# Altium schematic sheet TopView.SchDoc
size A4
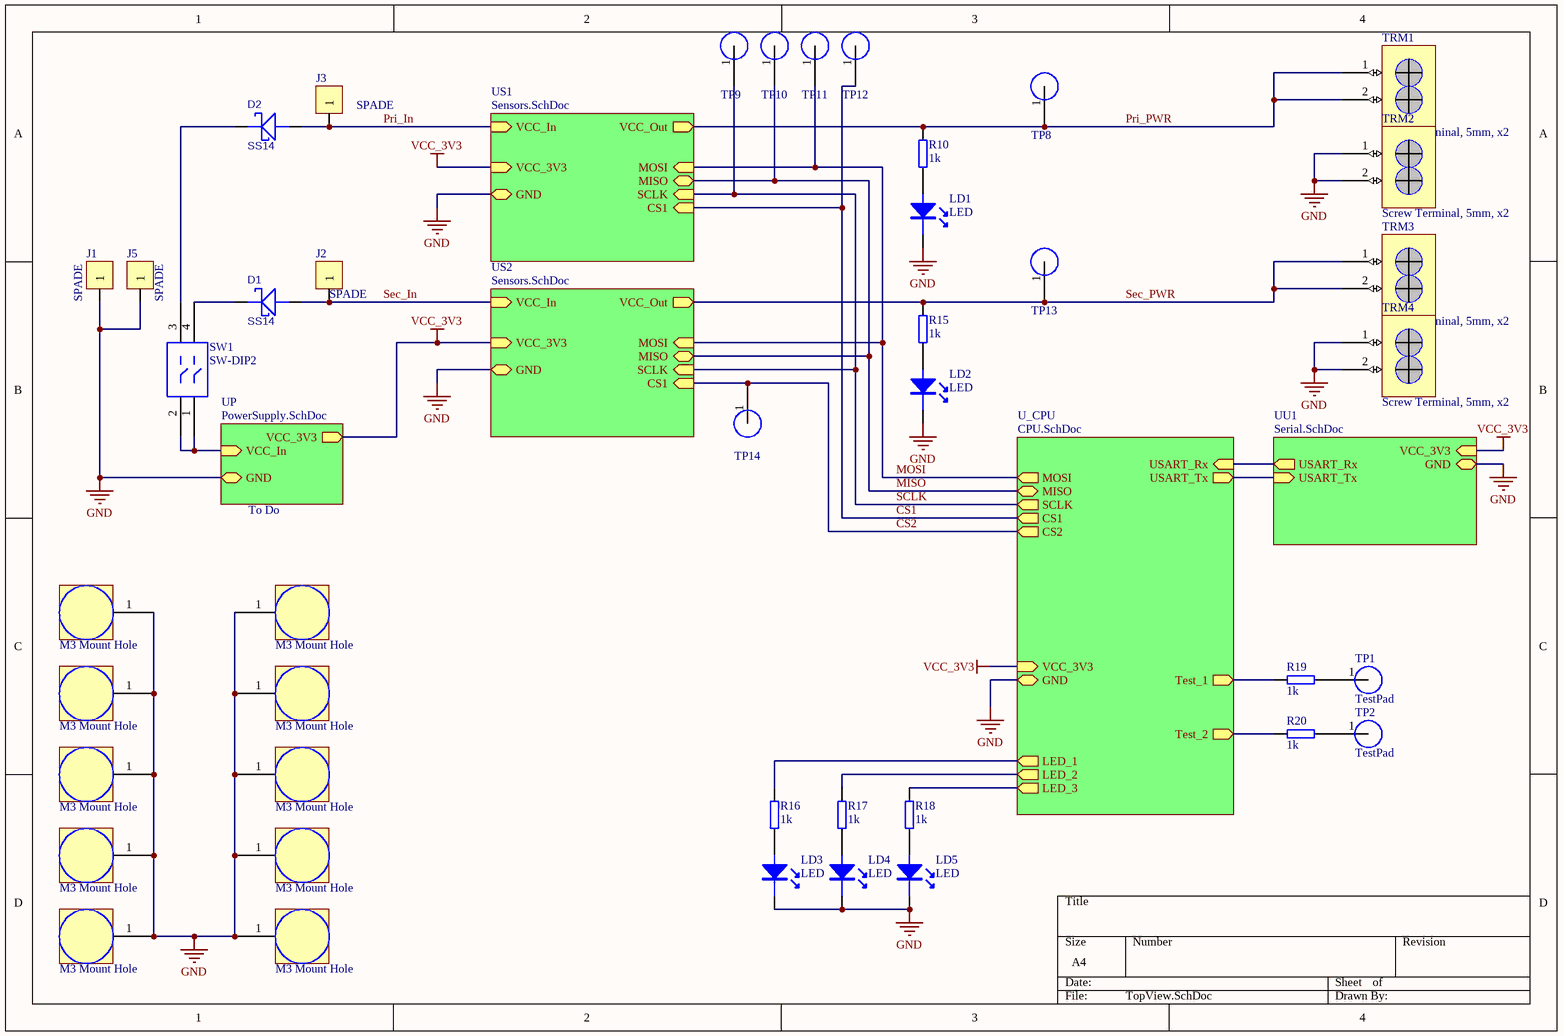
[diagram p0: TopView.SchDoc]

## Parts
D1  SS14  [DO-214AC]
D2  SS14  [DO-214AC]
J1  SPADE  [SPADE6.3-V]
J2  SPADE  [SPADE6.3-V]
J3  SPADE  [SPADE6.3-V]
J5  SPADE  [SPADE6.3-V]
LD1  LED  [LED3]
LD2  LED  [LED3]
LD3  LED  [LED3]
LD4  LED  [LED3]
LD5  LED  [LED3]
MNT1  M3 Mount Hole  [Mount_M3]
MNT2  M3 Mount Hole  [Mount_M3]
MNT3  M3 Mount Hole  [Mount_M3]
MNT4  M3 Mount Hole  [Mount_M3]
MNT5  M3 Mount Hole  [Mount_M3]
MNT6  M3 Mount Hole  [Mount_M3]
MNT7  M3 Mount Hole  [Mount_M3]
MNT8  M3 Mount Hole  [Mount_M3]
MNT9  M3 Mount Hole  [Mount_M3]
MNT10  M3 Mount Hole  [Mount_M3]
R10  1k  [0603]
R15  1k  [0603]
R16  1k  [0603]
R17  1k  [0603]
R18  1k  [0603]
R19  1k  [0603]
R20  1k  [0603]
SW1  SW-DIP2  [DIPSW2]
TP1  TestPad  [TestPad]
TP2  TestPad  [TestPad]
TP8  TestPad  [TestPad]  (value not drawn)
TP9  TestPad  [TestPad]  (value not drawn)
TP10  TestPad  [TestPad]  (value not drawn)
TP11  TestPad  [TestPad]  (value not drawn)
TP12  TestPad  [TestPad]  (value not drawn)
TP13  TestPad  [TestPad]  (value not drawn)
TP14  TestPad  [TestPad]  (value not drawn)
TRM1  Screw Terminal, 5mm, x2  [Terms5mm2]
TRM2  Screw Terminal, 5mm, x2  [Terms5mm2]
TRM3  Screw Terminal, 5mm, x2  [Terms5mm2]
TRM4  Screw Terminal, 5mm, x2  [Terms5mm2]

## Sub-sheets
U_CPU = CPU.SchDoc: GND (bidir), VCC_3V3 (in), MOSI (out), MISO (bidir), SCLK (out), CS1 (out), CS2 (out), LED_1 (out), LED_2 (out), LED_3 (out), Test_1 (out), Test_2 (out), USART_Tx (out), USART_Rx (in)
UP = PowerSupply.SchDoc: VCC_In (in), GND (bidir), VCC_3V3 (out)
US1 = Sensors.SchDoc: VCC_In (in), VCC_Out (out), VCC_3V3 (in), GND (bidir), MOSI (in), MISO (bidir), SCLK (in), CS1 (in)
US2 = Sensors.SchDoc: VCC_In (in), VCC_Out (out), VCC_3V3 (in), GND (bidir), MOSI (in), MISO (bidir), SCLK (in), CS1 (in)
UU1 = Serial.SchDoc: GND (bidir), VCC_3V3 (in), USART_Tx (in), USART_Rx (out)

## Nets
GND: J1.1 J5.1 LD1.K LD2.K LD3.K LD4.K LD5.K MNT1.1 MNT2.1 MNT3.1 MNT4.1 MNT5.1 MNT6.1 MNT7.1 MNT8.1 MNT9.1 MNT10.1 TRM2.1 TRM2.2 TRM4.1 TRM4.2 ; sheet UP/GND, sheet US1/GND, sheet US2/GND, sheet UU1/GND, sheet U_CPU/GND
VCC_3V3: sheet UP/VCC_3V3, sheet US1/VCC_3V3, sheet US2/VCC_3V3, sheet UU1/VCC_3V3, sheet U_CPU/VCC_3V3
CS1: TP12.1 ; sheet US1/CS1, sheet U_CPU/CS1
CS2: TP14.1 ; sheet US2/CS1, sheet U_CPU/CS2
MISO: TP10.1 ; sheet US1/MISO, sheet US2/MISO, sheet U_CPU/MISO
MOSI: TP11.1 ; sheet US1/MOSI, sheet US2/MOSI, sheet U_CPU/MOSI
Pri_In: D2.A J3.1 ; sheet US1/VCC_In
Pri_PWR: R10.2 TP8.1 TRM1.1 TRM1.2 ; sheet US1/VCC_Out
SCLK: TP9.1 ; sheet US1/SCLK, sheet US2/SCLK, sheet U_CPU/SCLK
Sec_In: D1.A J2.1 ; sheet US2/VCC_In
Sec_PWR: R15.2 TP13.1 TRM3.1 TRM3.2 ; sheet US2/VCC_Out
NetD1_K: D1.K SW1.4
NetD2_K: D2.K SW1.3
NetLD1_A: LD1.A R10.1
NetLD2_A: LD2.A R15.1
NetLD3_A: LD3.A R16.1
NetLD4_A: LD4.A R17.1
NetLD5_A: LD5.A R18.1
NetR16_2: R16.2 ; sheet U_CPU/LED_1
NetR17_2: R17.2 ; sheet U_CPU/LED_2
NetR18_2: R18.2 ; sheet U_CPU/LED_3
NetR19_1: R19.1 TP1.1
NetR19_2: R19.2 ; sheet U_CPU/Test_1
NetR20_1: R20.1 TP2.1
NetR20_2: R20.2 ; sheet U_CPU/Test_2
NetSW1_1: SW1.1 SW1.2 ; sheet UP/VCC_In
(unnamed): sheet UU1/USART_Tx, sheet U_CPU/USART_Tx
(unnamed): sheet UU1/USART_Rx, sheet U_CPU/USART_Rx

## Notes on the sheet
- To Do

## Library data of the parts
D1 D2 = DIODE SCHOTTKY
J1-J3 J5 = CON1
MNT1-MNT10 = M3_Mount: Supplier1: N/A; PartNo1: N/A; PartNo2: N/A; Supplier2: N/A
R10 R15-R20 = RES8
TP1 TP2 TP8-TP14 = TestPad: Test Pad; Supplier1: N/A; PartNo1: N/A; PartNo2: N/A; Supplier2: N/A
TRM1-TRM4 = ScrewTerms5mm2: PartNo1: P2034A; Rating: 20A, 300Vac; Supplier1: Altronics; PartNo2: -; Supplier2: -